# EAGLE schematic 1.a.ii.5_op-amp-level-translation_schem (EAGLE 7.1.0)
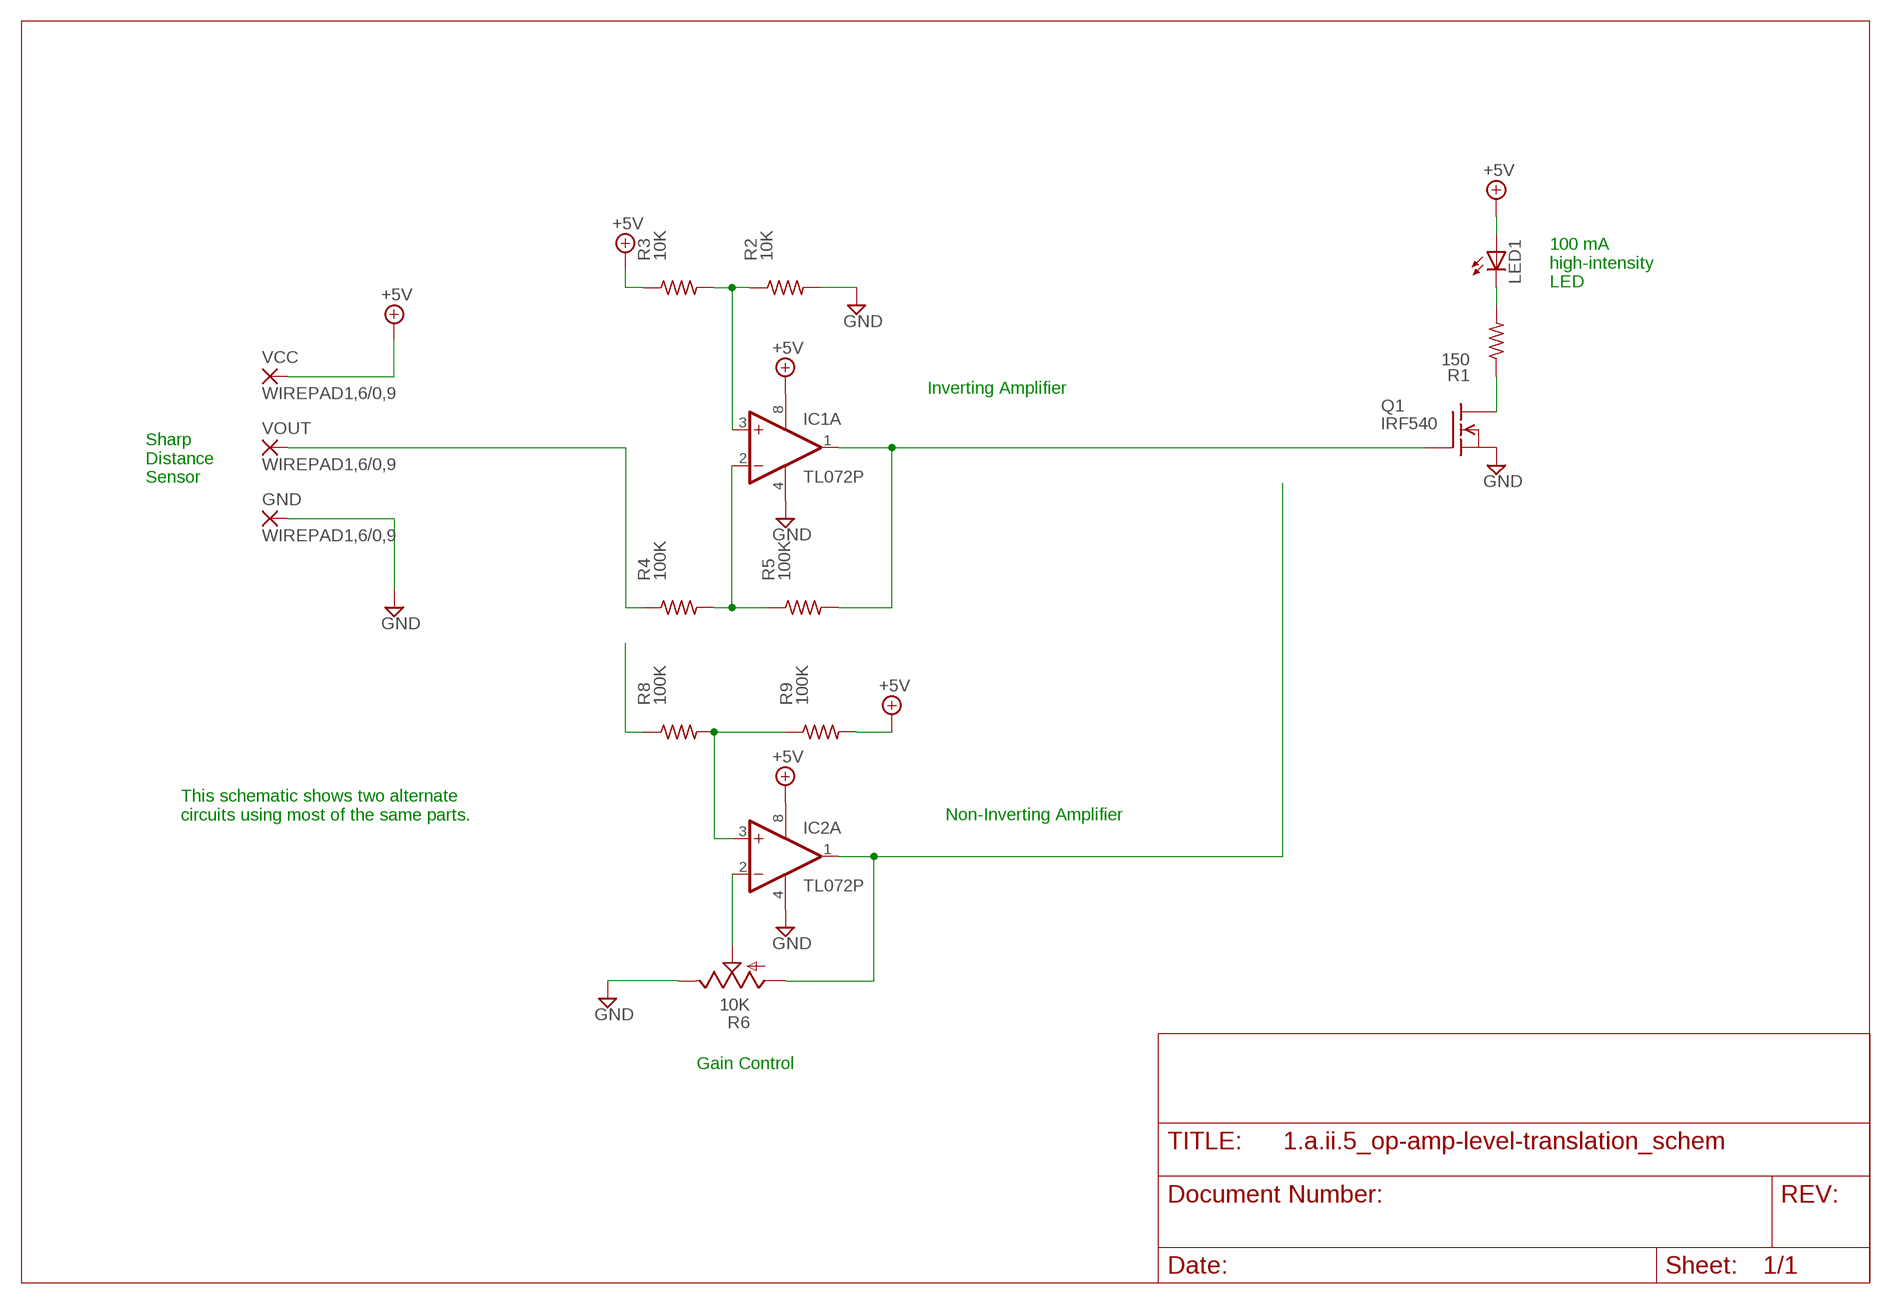
[diagram p0: schematic, sheet 1]

## Parts
GND  WIREPAD1,6/0,9  [1,6/0,9]
IC1  TL072P  [DIL08]
IC2  TL072P  [DIL08]
LED1  LED10MM  [LED10MM]
Q1  IRF540  [TO220]
R1  150  R-US_0204/7  [0204/7]
R2  10K  R-US_0204/7  [0204/7]
R3  10K  R-US_0204/7  [0204/7]
R4  100K  R-US_0204/7  [0204/7]
R5  100K  R-US_0204/7  [0204/7]
R6  10K  TRIM_US-B25V  [B25V]
R8  100K  R-US_0204/7  [0204/7]
R9  100K  R-US_0204/7  [0204/7]
VCC  WIREPAD1,6/0,9  [1,6/0,9]
VOUT  WIREPAD1,6/0,9  [1,6/0,9]

## Nets
+5V: IC1.8(P:V+) IC2.8(P:V+) LED1.A R3.1 R9.2 VCC.1(P)
GND: GND.1(P) IC1.4(P:V-) IC2.4(P:V-) Q1.3(S) R2.2
N$1: IC1.3(A:+IN) R2.1 R3.2
N$2: LED1.K(C) R1.2
N$3: R4.1 VOUT.1(P)
N$4: IC1.2(A:-IN) R4.2 R5.1
N$5: IC1.1(A:OUT) R5.2
N$6: IC2.3(A:+IN) R8.2 R9.1
N$8: IC2.2(A:-IN) R6.S
N$9: Q1.2(D) R1.1
N$10: R8.1
N$11: IC2.1(A:OUT)
Unconnected: IC1.5(B:+IN) IC1.6(B:-IN) IC1.7(B:OUT) IC2.5(B:+IN) IC2.6(B:-IN) IC2.7(B:OUT) Q1.1(G) R6.A R6.E

## Notes on the sheet
- 100 mA
  high-intensity
  LED
- Inverting Amplifier
- Sharp
  Distance
  Sensor
- This schematic shows two alternate
  circuits using most of the same parts.
- Non-Inverting Amplifier
- Gain Control

## Library data of the parts
GND VCC VOUT = wirepad:WIREPAD: Wire PAD connect wire on PCB
IC1 IC2 = linear:TL072: OP AMP
LED1 = led:LED: LED OSRAM: - CHIPLED LG R971, LG N971, LY N971, LG Q971, LY Q971, LO R971, LY R971 LH N974, LH R974 LS Q976, LO Q976, LY Q976 LO Q996 - Hyper CHIPLED LW Q18S LB Q993, LB Q99A, LB R99A - SideLED LS A670, LO A670, LY A670, LG A670, LP A670 LB A673, LV A673, LT A673, LW A673 LH A674 LY A675 LS A676, LA A676, LO A676, LY A676, LW A676 LS A679, LY A679, LG A679 - Hyper Micro SIDELED® LS Y876, LA Y876, LO Y876, LY Y876 LT Y87S - SmartLED LW L88C, LW L88S LB L89C, LB L89S, LG L890 LS L89K, LO L89K, LY L89K LS L896, LA L896, LO L896, LY L896 - TOPLED LS T670, LO T670, LY T670, LG T670, LP T670 LSG T670, LSP T670, LSY T670, LOP T670, LYG T670 LG T671, LOG T671, LSG T671 LB T673, LV T673, LT T673, LW T673 LH T674 LS T676, LA T676, LO T676, LY T676, LB T676, LH T676, LSB T676, LW T676 LB T67C, LV T67C, LT T67C, LS T67K, LO T67K, LY T67K, LW E67C LS E67B, LA E67B, LO E67B, LY E67B, LB E67C, LV E67C, LT E67C LW T67C LS T679, LY T679, LG T679 LS T770, LO T770, LY T770, LG T770, LP T770 LB T773, LV T773, LT T773, LW T773 LH T774 LS E675, LA E675, LY E675, LS T675 LS T776, LA T776, LO T776, LY T776, LB T776 LHGB T686 LT T68C, LB T68C - Hyper Mini TOPLED® LB M676 - Mini TOPLED Santana® LG M470 LS M47K, LO M47K, LY M47K Source: http://www.osram.convergy.de LUXEON: - LUMILED® LXK2-PW12-R00, LXK2-PW12-S00, LXK2-PW14-U00, LXK2-PW14-V00 LXK2-PM12-R00, LXK2-PM12-S00, LXK2-PM14-U00 LXK2-PE12-Q00, LXK2-PE12-R00, LXK2-PE12-S00, LXK2-PE14-T00, LXK2-PE14-U00 LXK2-PB12-K00, LXK2-PB12-L00, LXK2-PB12-M00, LXK2-PB14-N00, LXK2-PB14-P00, LXK2-PB14-Q00 LXK2-PR12-L00, LXK2-PR12-M00, LXK2-PR14-Q00, LXK2-PR14-R00 LXK2-PD12-Q00, LXK2-PD12-R00, LXK2-PD12-S00 LXK2-PH12-R00, LXK2-PH12-S00 LXK2-PL12-P00, LXK2-PL12-Q00, LXK2-PL12-R00 Source: www.luxeon.com KINGBRIGHT: KA-3528ASYC Source: www.kingbright.com
Q1 = transistor-fet:IRF540: N-Channel Enhancement MOSFET (HEXFET); 100V; 28A; 0,077Ohm
R1-R5 R8 R9 = resistor:R-US_: RESISTOR, American symbol
R6 = pot:TRIM_US-: POTENTIOMETER